# Altium schematic sheet mdriver.SchDoc
size A4
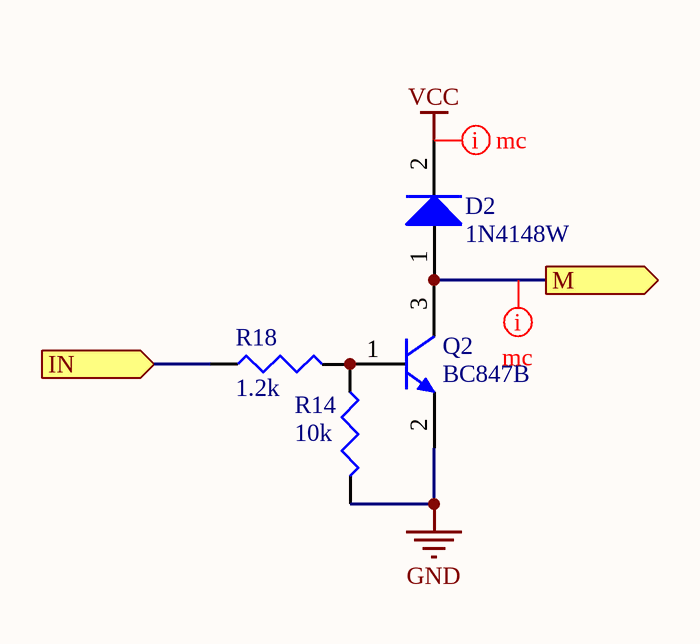
[diagram p0: mdriver.SchDoc]

## Parts
D2  1N4148W  [SOD-123]
Q2  BC847B  [SOT-23_N]
R14  10k  [J1-0603]
R18  1.2k  [J1-0603]

## Ports
IN (in), M (out)

## Nets
GND: Q2.2(E) R14.2
VCC: D2.2(K)
IN: R18.1 ; port IN
M: D2.1(A) Q2.3(C) ; port M
NetQ2_1: Q2.1(B) R14.1 R18.2

## Layout directives
net class mc: M, VCC

## Library data of the parts
D2 = Diode: Default Diode; Published: 8-Jun-2000; LatestRevisionDate: 17-Jul-2002; LatestRevisionNote: Re-released for DXP Platform.; PackageVersion: Sep-1996; PackageReference: SMC; Publisher: Altium Limited; PackageDescription: DO-214-AB/SMC; 2 C-Bend Leads; Body 7.9 x 5.9 mm, inc. leads (LxW); Code_JEDEC: DO-214-AB
Q2 = NPN: NPN Bipolar Transistor; Published: 8-Jun-2000; LatestRevisionDate: 17-Jul-2002; LatestRevisionNote: Re-released for DXP Platform.; PackageReference: TO-226-AA; Publisher: Altium Limited; PackageDescription: TO, Flat Index; 3 In-Line, Axial Leads; Body Dia. 4.8mm; Leads 0.55 x 0.51 mm (max); Code_JEDEC: TO-226-AA
R14 R18 = Res3: Resistor; Published: 8-Jun-2000; LatestRevisionDate: 29-May-2009; LatestRevisionNote: IPC-7351 Footprint Added.; PackageReference: J1-0603; Publisher: Altium Limited; PackageDescription: Chip Resistor
  R14: Value: 10K
  R18: Value: 1.2K